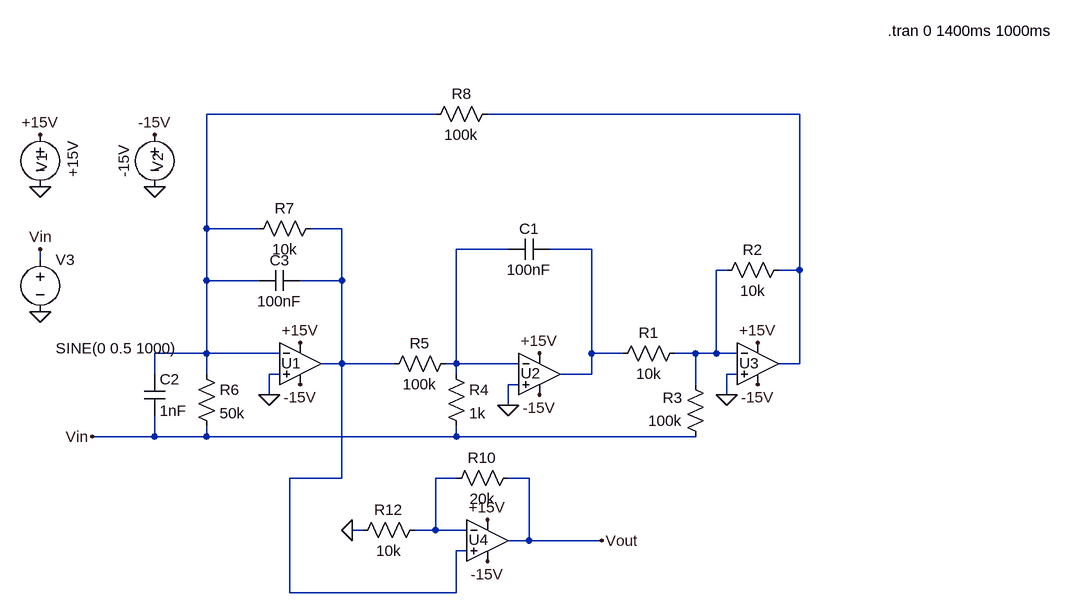
[diagram p0: schematic Lag_Compensator.asc]
Lag_Compensator.asc, the LTspice schematic file:
Version 4.1
SHEET 1 2000 680
WIRE 384 -176 32 -176
WIRE 944 -176 464 -176
WIRE 32 0 32 -176
WIRE 112 0 32 0
WIRE 240 0 192 0
WIRE 496 32 416 32
WIRE 624 32 560 32
WIRE -224 48 -224 32
WIRE 832 64 816 64
WIRE 944 64 944 -176
WIRE 944 64 912 64
WIRE 32 80 32 0
WIRE 112 80 32 80
WIRE 240 80 240 0
WIRE 240 80 176 80
WIRE 32 192 32 80
WIRE 32 192 -48 192
WIRE 144 192 32 192
WIRE 624 192 624 32
WIRE 672 192 624 192
WIRE 784 192 752 192
WIRE 816 192 816 64
WIRE 816 192 784 192
WIRE 848 192 816 192
WIRE 240 208 240 80
WIRE 240 208 208 208
WIRE 320 208 240 208
WIRE 416 208 416 32
WIRE 416 208 400 208
WIRE 512 208 416 208
WIRE 944 208 944 64
WIRE 944 208 912 208
WIRE -48 224 -48 192
WIRE 32 224 32 192
WIRE 144 224 128 224
WIRE 416 224 416 208
WIRE 624 224 624 192
WIRE 624 224 576 224
WIRE 848 224 832 224
WIRE 512 240 496 240
WIRE 784 240 784 192
WIRE 128 256 128 224
WIRE 832 256 832 224
WIRE 496 272 496 240
WIRE -48 320 -48 288
WIRE -48 320 -144 320
WIRE 32 320 32 304
WIRE 32 320 -48 320
WIRE 416 320 416 304
WIRE 416 320 32 320
WIRE 784 320 416 320
WIRE 240 384 240 208
WIRE 240 384 160 384
WIRE 416 384 384 384
WIRE 528 384 496 384
WIRE 272 464 256 464
WIRE 384 464 384 384
WIRE 384 464 352 464
WIRE 432 464 384 464
WIRE 528 480 528 384
WIRE 528 480 496 480
WIRE 640 480 528 480
WIRE 432 496 416 496
WIRE 160 560 160 384
WIRE 416 560 416 496
WIRE 416 560 160 560
FLAG -224 -64 0
FLAG -48 -64 0
FLAG -48 -144 -15V
FLAG 176 240 -15V
FLAG -224 -144 +15V
FLAG 176 176 +15V
FLAG 544 256 -15V
FLAG 544 192 +15V
FLAG 880 240 -15V
FLAG 880 176 +15V
FLAG 832 256 0
FLAG 496 272 0
FLAG 128 256 0
FLAG 640 480 Vout
FLAG -144 320 Vin
FLAG -224 32 Vin
FLAG -224 128 0
FLAG 464 512 -15V
FLAG 464 448 +15V
FLAG 256 464 0
DATAFLAG 752 320 ""
SYMBOL OpAmps\\UniversalOpAmp2 176 208 R0
WINDOW 0 -29 -1 Left 2
SYMATTR InstName U1
SYMBOL voltage -224 -160 R0
WINDOW 0 -13 59 VTop 2
WINDOW 3 66 53 VBottom 2
WINDOW 123 0 0 Left 0
WINDOW 39 0 0 Left 0
SYMATTR InstName V1
SYMATTR Value +15V
SYMBOL voltage -48 -160 R0
WINDOW 0 -11 58 VTop 2
WINDOW 3 -32 56 VBottom 2
WINDOW 123 0 0 Left 0
WINDOW 39 0 0 Left 0
SYMATTR InstName V2
SYMATTR Value -15V
SYMBOL OpAmps\\UniversalOpAmp2 544 224 R0
WINDOW 0 -29 -1 Left 2
SYMATTR InstName U2
SYMBOL OpAmps\\UniversalOpAmp2 880 208 R0
WINDOW 0 -29 -1 Left 2
SYMATTR InstName U3
SYMBOL res 768 176 R90
WINDOW 0 0 56 VBottom 2
WINDOW 3 32 56 VTop 2
SYMATTR InstName R1
SYMATTR Value 10k
SYMBOL res 928 48 R90
WINDOW 0 0 56 VBottom 2
WINDOW 3 32 56 VTop 2
SYMATTR InstName R2
SYMATTR Value 10k
SYMBOL res 800 336 R180
WINDOW 0 36 76 Left 2
WINDOW 3 36 40 Left 2
SYMATTR InstName R3
SYMATTR Value 100k
SYMBOL res 400 208 R0
SYMATTR InstName R4
SYMATTR Value 1k
SYMBOL res 416 192 R90
WINDOW 0 0 56 VBottom 2
WINDOW 3 32 56 VTop 2
SYMATTR InstName R5
SYMATTR Value 100k
SYMBOL cap 560 16 R90
WINDOW 0 0 32 VBottom 2
WINDOW 3 32 32 VTop 2
SYMATTR InstName C1
SYMATTR Value 100nF
SYMBOL res 16 208 R0
SYMATTR InstName R6
SYMATTR Value 50k
SYMBOL cap -64 224 R0
SYMATTR InstName C2
SYMATTR Value 1nF
SYMBOL res 208 -16 R90
WINDOW 0 0 56 VBottom 2
WINDOW 3 32 56 VTop 2
SYMATTR InstName R7
SYMATTR Value 10k
SYMBOL cap 176 64 R90
WINDOW 0 0 32 VBottom 2
WINDOW 3 32 32 VTop 2
SYMATTR InstName C3
SYMATTR Value 100nF
SYMBOL res 480 -192 R90
WINDOW 0 0 56 VBottom 2
WINDOW 3 32 56 VTop 2
SYMATTR InstName R8
SYMATTR Value 100k
SYMBOL voltage -224 32 R0
WINDOW 123 24 124 Left 2
WINDOW 39 0 0 Left 0
WINDOW 3 24 152 Left 2
SYMATTR InstName V3
SYMATTR Value SINE(0 0.5 1000)
SYMBOL OpAmps\\UniversalOpAmp2 464 480 R0
WINDOW 0 -29 -1 Left 2
SYMATTR InstName U4
SYMBOL res 512 368 R90
WINDOW 0 0 56 VBottom 2
WINDOW 3 32 56 VTop 2
SYMATTR InstName R10
SYMATTR Value 20k
SYMBOL res 368 448 R90
WINDOW 0 0 56 VBottom 2
WINDOW 3 32 56 VTop 2
SYMATTR InstName R12
SYMATTR Value 10k
TEXT 1080 -304 Left 2 !.tran 0 1400ms 1000ms

The netlist it stands for:
* Lag_Compensator.asc
X§U1 0 N001 +15V -15V N003 level2 Avol=1Meg GBW=10Meg Slew=10Meg Ilimit=25m Rail=0 Vos=0 En=0 Enk=0 In=0 Ink=0 Rin=500Meg  ; pins In+ In- V+ V- OUT
V1 +15V 0 +15V
V2 -15V 0 -15V
X§U2 0 N004 +15V -15V N005 level2 Avol=1Meg GBW=10Meg Slew=10Meg Ilimit=25m Rail=0 Vos=0 En=0 Enk=0 In=0 Ink=0 Rin=500Meg  ; pins In+ In- V+ V- OUT
X§U3 0 N006 +15V -15V N002 level2 Avol=1Meg GBW=10Meg Slew=10Meg Ilimit=25m Rail=0 Vos=0 En=0 Enk=0 In=0 Ink=0 Rin=500Meg  ; pins In+ In- V+ V- OUT
R1 N006 N005 10k
R2 N002 N006 10k
R3 Vin N006 100k
R4 N004 Vin 1k
R5 N004 N003 100k
C1 N005 N004 100nF
R6 N001 Vin 50k
C2 N001 Vin 1nF
R7 N003 N001 10k
C3 N003 N001 100nF
R8 N002 N001 100k
V3 Vin 0 SINE(0 0.5 1000)
X§U4 N003 N007 +15V -15V Vout level2 Avol=1Meg GBW=10Meg Slew=10Meg Ilimit=25m Rail=0 Vos=0 En=0 Enk=0 In=0 Ink=0 Rin=500Meg  ; pins In+ In- V+ V- OUT
R10 Vout N007 20k
R12 N007 0 10k
.tran 0 1400ms 1000ms
.lib UniversalOpAmp2.lib
.backanno
.end